# EAGLE board teensyMotors02_up_LED_SX (EAGLE 9.1.3), part 1 of 2
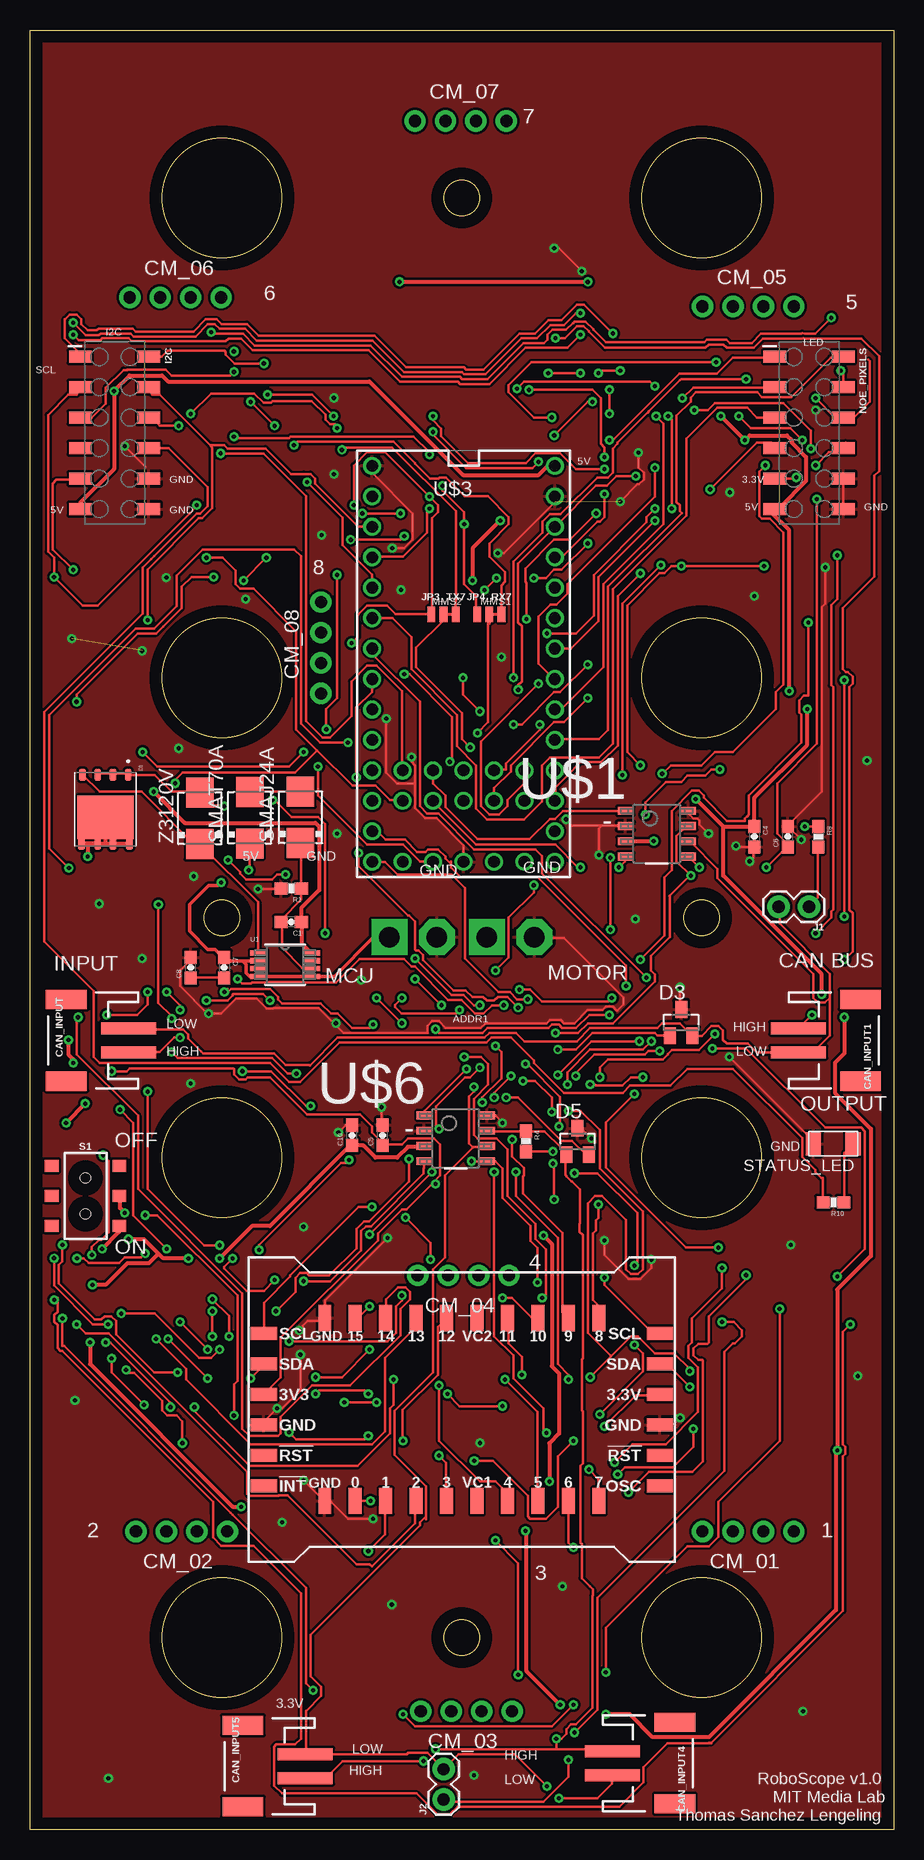
[diagram p2: board, top side]
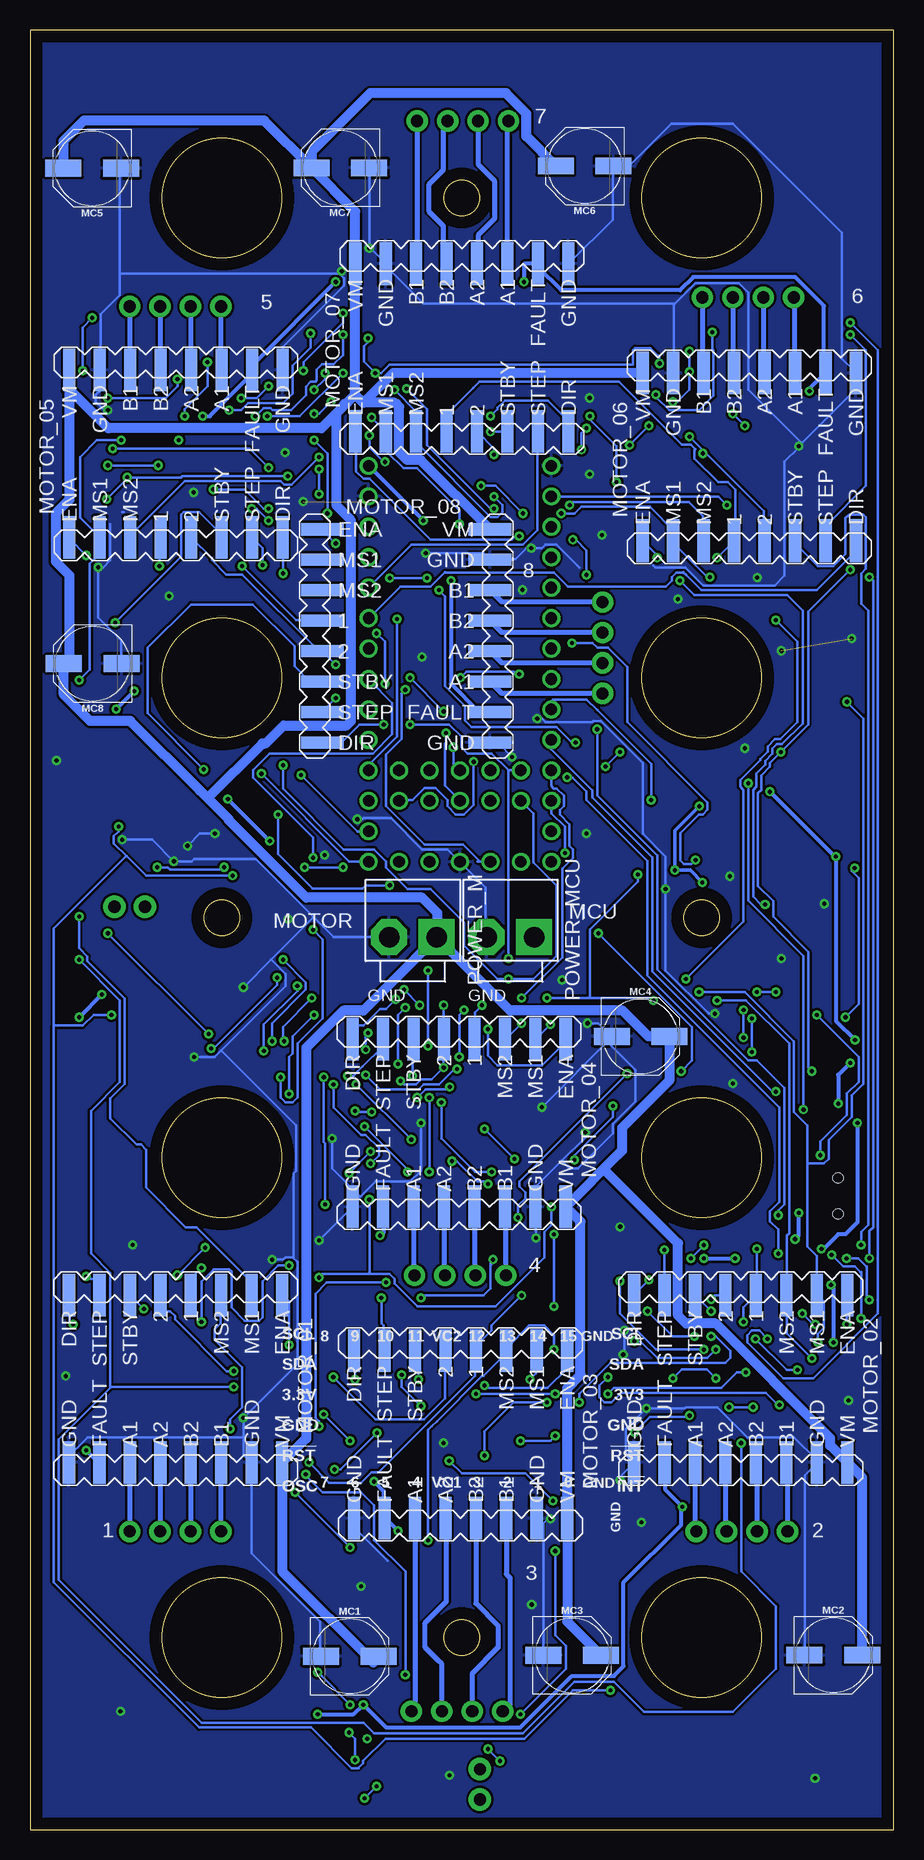
[diagram p3: board, bottom side, seen from below]

Size 72 x 150 mm. Coordinates in mm from the lower left corner, seen from the top.
Outline: 72,150 72,0 0,0 0,150 72,150
Outline: circle at 56,136 radius 5
Outline: circle at 56,96 radius 5
Outline: circle at 56,56 radius 5
Outline: circle at 56,16 radius 5
Outline: circle at 16,16 radius 5
Outline: circle at 16,56 radius 5
Outline: circle at 16,96 radius 5
Outline: circle at 16,136 radius 5
Outline: circle at 36,136 radius 1.5
Outline: circle at 16,76 radius 1.5
Outline: circle at 36,16 radius 1.5
Outline: circle at 56,76 radius 1.5
Copper layers (1*16): Top 0.035mm / dielectric 1.5mm / Bottom 0.035mm
Design rules "default *": minimum track width 6mil, minimum drill 0.35mm, track to track 6mil, track to pad 6mil, pad to pad 6mil, via to via 6mil, smd to smd 6mil, copper to edge 40mil, drill to drill 6mil, minimum pad ring 10mil, minimum via ring 8mil, stop-mask expansion 4mil, vias tented up to drill 0mil, thermal gap 10mil
Net classes: 0 default: width 0.2 mm, clearance 0.2 mm; 1 gnd: width 0.2 mm, clearance 0.2 mm; 3 vcc: width 0.2 mm, clearance 0.2 mm; 4 vcc5: width 0.35 mm, clearance 0.2 mm

## Footprints (pad centres in the part's own frame; a part is rotated, then mirrored left to right if it is on the bottom)
0603-CAP = smd 1.1 x 1: 1 -0.85,0; 2 0.85,0
JST-2-SMD = smd 1 x 4.6: 1 -1,-3.7; 2 1,-3.7 | smd 1.6 x 3.4: NC1 -3.4,1.5; NC2 3.4,1.5
1X04-CLEANBIG = drill 1.016 pad 1.778: 1 -3.81,0; 2 -1.27,0; 3 1.27,0; 4 3.81,0
SOFL127P515X615X110-9N = smd 1.03 x 0.57: 1 -2.87,1.905; 2 -2.87,0.635; 3 -2.87,-0.635; 4 -2.87,-1.905; 5 2.87,-2; 6 2.87,-0.635; 7 2.87,0.635; 8 2.87,2 | smd 3.6 x 4.7: 9 0.675,0
SOT23 = smd 1 x 1.4: 1 -0.95,-1.1; 2 0.95,-1.1; 3 0,1.1
2X6_SMD = smd 1.02 x 1.9: 1 -6.35,-2.85; 2 -6.35,2.85; 3 -3.81,-2.85; 4 -3.81,2.85; 5 -1.27,-2.85; 6 -1.27,2.85; 7 1.27,-2.85; 8 1.27,2.85; 9 3.81,-2.85; 10 3.81,2.85; 11 6.35,-2.85; 12 6.35,2.85
1X02 = drill 1.016 pad 1.88: 1 0,0; 2 2.54,0
SMT-JUMPER_3_1-NC_TRACE_NO-SILK = smd 0.635 x 1.27: 1 -1.016,0; 2 0,0; 3 1.016,0
PANASONIC_D = smd 3 x 1.4: + 2.4,0; - -2.4,0
DRV8880 = smd 3.556 x 1.016: 1 -6.985,1.27; 2 -6.985,-1.27; A1 6.985,-3.81; A2 6.985,-1.27; B1 6.985,3.81; B2 6.985,1.27; DIR -6.985,-8.89; ENA -6.985,8.89; FAULT 6.985,-6.35; GND_0 6.985,-8.89; GND_1 6.985,6.35; MS1 -6.985,6.35; MS2 -6.985,3.81; STBY -6.985,-3.81; STEP -6.985,-6.35; VM 6.985,8.89
B2P-VH = drill 1.7 pad 3 square: 1 -1.98,0 | drill 1.7 pad 3 octagon: 2 1.98,0
0603-RES = smd 1.1 x 1: 1 -0.85,0; 2 0.85,0
SWITCH_DPDT_SMD_AYZ0202 = smd 1 x 1.15: 1 -2.5,2.825; 2 0,2.825; 3 2.5,2.825; 4 -2.5,-2.825; 5 0,-2.825; 6 2.5,-2.825 | hole 0.85: 1.5,0; -1.5,0
DO214AA = smd 2.5 x 2.3: A 2.15,0; C -2.15,0
LED1206FAB = smd 1.27 x 1.905: 1 -1.651,0; 2 1.651,0
MSOP-8_MS = smd 1.397 x 0.432: 1 -2.21,0.975; 2 -2.21,0.325; 3 -2.21,-0.325; 4 -2.21,-0.975; 5 2.21,-0.975; 6 2.21,-0.325; 7 2.21,0.325; 8 2.21,0.975
MCP2562 = smd 1.27 x 0.635: CANH 2.625,0.635; CANL 2.625,-0.635; RXD -2.625,-1.905; STBY 2.625,1.905; TXD -2.625,1.905; VDD -2.625,-0.635; VIO 2.625,-1.905; VSS -2.625,0.635
TEENSY_4.0_WITH_SMD_HEADER_PINS = drill 0.965: 0 -7.62,13.97; 1 -7.62,11.43; 2 -7.62,8.89; 3 -7.62,6.35; 3.3V 7.62,11.43; 3.3V1 -2.54,-16.51; 4 -7.62,3.81; 5 -7.62,1.27; 6 -7.62,-1.27; 7 -7.62,-3.81; 8 -7.62,-6.35; 9 -7.62,-8.89; 10 -7.62,-11.43; 11 -7.62,-13.97; 12 -7.62,-16.51; 13 7.62,-16.51; 14/A0 7.62,-13.97; 15/A1 7.62,-11.43; 16/A2 7.62,-8.89; 17/A3 7.62,-6.35; 18/A4 7.62,-3.81; 19/A5 7.62,-1.27; 20/A6 7.62,1.27; 21/A7 7.62,3.81; 22/A8 7.62,6.35; 23/A9 7.62,8.89; 24 5.08,-11.43; 25 5.08,-8.89; 26 2.54,-11.43; 27 2.54,-8.89; 28 0,-11.43; 29 0,-8.89; 30 -2.54,-11.43; 31 -2.54,-8.89; 32 -5.08,-11.43; 33 -5.08,-8.89; GND -7.62,16.51; GND1 0,-16.51; GND2 7.62,13.97; PGM 2.54,-16.51; RESET 5.08,-16.51; VBAT -5.08,-16.51; VIN 7.62,16.51
SX1509 = smd 2.184 x 1.067: 0 -7.62,7.62; 1 -7.62,5.08; 2 -7.62,2.54; 3 -7.62,0; 4 -7.62,-5.08; 5 -7.62,-7.62; 6 -7.62,-10.16; 7 -7.62,-12.7; 8 7.62,-12.7; 9 7.62,-10.16; 10 7.62,-7.62; 11 7.62,-5.08; 12 7.62,0; 13 7.62,2.54; 14 7.62,5.08; 15 7.62,7.62; GND_1 7.62,10.16; GND_2 -7.62,10.16; VC2 7.62,-2.54; VCC1 -7.62,-2.54 | smd 1.067 x 2.184: 3.3V 1.27,-17.78; 3.3V_1 1.27,15.24; GND -1.27,-17.78; GND_3 -1.27,15.24; INT -6.35,15.24; OSC -6.35,-17.78; RST -3.81,-17.78; RST_1 -3.81,15.24; SCL 6.35,-17.78; SCL_2 6.35,15.24; SDA 3.81,-17.78; SDA_2 3.81,15.24

## Placement (x,y rotation side)
C1  1.5uf  [0603-CAP]  21.78,75.65 180 top
C4  0.1uf  [0603-CAP]  60.39,82.76 270 top
C5  0.1uf  [0603-CAP]  29.4,57.87 90 top
C6  0.1uf  [0603-CAP]  63.18,82.76 90 top
C7  0.1uf  [0603-CAP]  16.19,71.84 270 top
C8  0.1uf  [0603-CAP]  13.4,71.84 90 top
C10  0.1uf  [0603-CAP]  26.86,57.87 90 top
CAN_INPUT  [JST-2-SMD]  4.53,65.78 90 top
CAN_INPUT1  [JST-2-SMD]  67.76,65.78 270 top
CAN_INPUT4  [JST-2-SMD]  52.26,5.54 270 top
CAN_INPUT5  [JST-2-SMD]  19.24,5.29 90 top
CM_01  1X04_STRAIGHT  [1X04-CLEANBIG]  59.88,24.85 180 top
CM_02  1X04_STRAIGHT  [1X04-CLEANBIG]  12.64,24.85 180 top
CM_03  1X04_STRAIGHT  [1X04-CLEANBIG]  36.39,9.86 180 top
CM_04  1X04_STRAIGHT  [1X04-CLEANBIG]  36.13,46.18 180 top
CM_05  1X04_STRAIGHT  [1X04-CLEANBIG]  59.88,126.95 0 top
CM_06  1X04_STRAIGHT  [1X04-CLEANBIG]  12.13,127.72 0 top
CM_07  1X04_STRAIGHT  [1X04-CLEANBIG]  35.91,142.42 0 top
CM_08  1X04_STRAIGHT  [1X04-CLEANBIG]  24.26,98.51 90 top
D1  BSC010NE2LSI  [SOFL127P515X615X110-9N]  6.29,85.04 270 top
D3  PESD1CAN  [SOT23]  54.29,67.26 0 top
D5  PESD1CAN  [SOT23]  45.66,57.36 0 top
I2C  [2X6_SMD]  7.05,116.41 270 top
J1  [1X02]  64.96,76.92 180 top
J2  [1X02]  34.48,2.49 90 top
JP3_TX7  JUMPER-SMT_3_1-NC_TRACE_NO-SILK  [SMT-JUMPER_3_1-NC_TRACE_NO-SILK]  34.48,101.3 0 top
JP4_RX7  JUMPER-SMT_3_1-NC_TRACE_NO-SILK  [SMT-JUMPER_3_1-NC_TRACE_NO-SILK]  38.29,101.3 0 top
MC1  100uF  [PANASONIC_D]  45.34,14.45 0 bottom
MC2  100uF  [PANASONIC_D]  5.02,14.54 0 bottom
MC3  100uF  [PANASONIC_D]  26.8,14.51 0 bottom
MC4  100uF  [PANASONIC_D]  21.1,66.1 0 bottom
MC5  100uF  [PANASONIC_D]  66.82,138.47 180 bottom
MC6  100uF  [PANASONIC_D]  25.75,138.67 180 bottom
MC7  100uF  [PANASONIC_D]  46.12,138.5 180 bottom
MC8  100uF  [PANASONIC_D]  66.77,97.18 180 bottom
MOTOR_01  DRV8880  [DRV8880]  59.86,37.57 270 bottom
MOTOR_02  DRV8880  [DRV8880]  12.74,37.57 270 bottom
MOTOR_03  DRV8880  [DRV8880]  36.09,32.94 270 bottom
MOTOR_04  DRV8880  [DRV8880]  36.22,58.89 270 bottom
MOTOR_05  DRV8880  [DRV8880]  59.83,114.68 90 bottom
MOTOR_06  DRV8880  [DRV8880]  12.02,114.43 90 bottom
MOTOR_07  DRV8880  [DRV8880]  35.99,123.54 90 bottom
MOTOR_08  DRV8880  [DRV8880]  40.63,99.49 0 bottom
NOE_PIXELS  [2X6_SMD]  64.96,116.41 270 top
POWER_M  B2P-VH  [B2P-VH]  40.07,74.38 180 bottom
POWER_MCU  B2P-VH  [B2P-VH]  31.94,74.38 180 bottom
R1  1K  [0603-RES]  21.78,78.44 180 top
R4  120Ohms  [0603-RES]  41.34,57.36 270 top
R8  120Ohms  [0603-RES]  65.72,82.76 270 top
R10  500  [0603-RES]  66.99,52.28 180 top
S1  [SWITCH_DPDT_SMD_AYZ0202]  4.63,52.82 270 top
SMAJ24A  S2M  [DO214AA]  22.56,84.37 90 top
SMAT70A  S2M  [DO214AA]  18.32,84.34 90 top
STATUS_LED  LEDFAB1206  [LED1206FAB]  66.97,57.15 180 top
U1  LTC4359CMS8PBF  [MSOP-8_MS]  21.27,72.09 0 top
U$1  MCP2562  [MCP2562]  52.26,83.01 0 top
U$3  TEENSY_4.0_WITH_SMD_HEADER_PINS  [TEENSY_4.0_WITH_SMD_HEADER_PINS]  36.15,97.17 0 top
U$5  SX1509  [SX1509]  34.74,35.01 90 top
U$6  MCP2562  [MCP2562]  35.5,57.61 0 top
Z3120V  S2M  [DO214AA]  14.16,84.28 90 top

## Tracks (layer width: path | path; a pad name or v marks a point on that pad's centre or on a via)
0_SX0  (via drill 0.35)
  Top 0.2: v28.41,27.41 27.21,27.41 U$5.0 | v37.04,30.72 38.59,30.72 41.51,27.81 41.51,26.11 41.71,25.91 43.01,25.91 44.01,26.91 44.01,31.11 v45.31,32.41 | v47.51,34.61 51.11,38.21 51.11,39.71 v50.41,40.41
  Bottom 0.2: v47.51,34.61 v45.31,32.41 | v50.41,40.41 50.41,44.01 50.91,44.51 MOTOR_01.ENA | v28.41,27.41 30.67,29.67 35.99,29.67 v37.04,30.72
1_SX0  (via drill 0.35)
  Top 0.2: v28.21,23.21 29.61,24.61 29.61,27.31 U$5.1 | v48.01,13.11 48.01,16.81 54.81,23.61 56.61,23.61 57.41,24.41 57.41,27.31 62.51,32.41 v62.51,43.41 | v45.31,10.41 43.51,8.61 32.11,8.61 v31.11,9.61
  Bottom 0.2: v28.21,23.21 28.21,16.21 27.31,15.31 27.31,13.41 v31.11,9.61 | v48.01,13.11 47.71,12.81 v45.31,10.41 | v62.51,43.41 63.61,44.51 MOTOR_01.STBY
2_SX0  (via drill 0.35)
  Top 0.2: U$5.2 32.11,27.31 32.11,25.51 28.52,21.92 28.33,22.11 27.24,22.11 21.49,27.86 20.75,27.86 20.71,27.82 18.28,27.82 18.1,28 18.1,29.79 6.54,41.36 4.66,41.36 v3.91,42.11
  Bottom 0.2: v3.91,42.11 3.91,44.51 MOTOR_02.ENA
3.3V  (via drill 0.35)
  Top 0.2: v61.41,80.21 63.11,81.91 C6.1 63.11,82.01 63.11,82.21 62.31,83.01 62.31,87.21 65.61,90.51 v65.61,110.91 | v55.81,80.21 54.91,81.11 U$1.VIO | v40.71,95.01 40.71,95.41 41.01,95.71 41.01,100.31 40.71,100.61 40.71,105.51 43.71,108.51 U$3.3.3V 43.81,108.61 47.21,112.01 48.11,112.01 48.91,112.81 v50.51,112.81 | 33.66,53.96 31.41,51.71 31.01,51.71 29.01,49.71 29.01,49.11 20.91,41.01 20.91,37.71 19.51,36.31 U$5.3.3V_1 | 33.66,53.96 34.21,54.51 34.21,57.11 33.71,57.61 31.51,57.61 31.01,57.11 29.41,57.11 C5.1 29.41,57.21 28.51,58.11 28.51,58.61 27.51,59.61 23.11,59.61 20.02,62.69 18.15,62.69 17.99,62.53 17.43,62.53 17.03,62.92 17.03,63.38 16.96,63.45 8.32,63.45 8.07,63.21 v6.81,63.21 | v36.81,55.71 38.11,55.71 U$6.VIO 38.21,55.71 38.81,55.71 39.41,55.11 39.41,52.63 41.73,50.31 41.73,49.06 42.31,48.48 42.31,45.93 | v33.81,53.81 33.71,53.91 33.66,53.96 | v47.91,33.61 50.51,36.21 52.51,36.21 U$5.3.3V | 42.31,46.01 42.31,45.93 | 42.31,45.93 v42.31,45.61 | v3.61,105.01 1.91,106.71 1.91,112.21 2.21,112.51 4.11,112.51 I2C.9 | v24.01,88.61 24.01,86.21 28.11,82.11 31.11,82.11 32.51,80.71 33.61,80.71 U$3.3.3V1 | v63.91,112.71 63.81,112.61 62.21,112.61 NOE_PIXELS.9 | v22.81,89.81 21.6,88.6 10.61,88.6 v9.41,89.81
  Bottom 0.2: v61.41,80.21 60.51,80.21 60.31,80.01 56.01,80.01 v55.81,80.21 | 34.71,80.71 34.48,80.71 | 34.48,80.71 33.61,80.71 U$3.3.3V1 | v40.71,95.01 41.01,94.71 41.01,90.91 42.31,89.61 42.31,85.31 39.11,82.11 35.88,82.11 34.48,80.71 | 63.81,112.71 59.41,112.71 59.31,112.81 v50.51,112.81 | 63.81,112.71 v63.91,112.71 63.81,112.71 | 63.81,112.71 v65.61,110.91 | v36.81,55.71 36.41,55.71 34.71,54.01 34.01,54.01 v33.81,53.81 | v47.91,33.61 47.91,34.01 48.21,34.31 48.21,39.81 48.2,39.81 48.2,44.66 47.25,45.61 v42.31,45.61 42.41,45.61 | v3.61,105.01 7.11,101.51 7.11,92.11 v9.41,89.81 10.31,88.91 10.31,88.59 11.03,87.87 11.03,86.65 11.31,86.38 11.31,78.66 10.03,77.39 10.03,76.08 7.11,73.16 7.11,63.51 v6.81,63.21 | v22.81,89.81 v24.01,88.61
3_SX0  (via drill 0.35)
  Top 0.2: v34.11,31.17 34.71,30.57 34.71,27.41 U$5.3 | v26.21,35.61 v28.91,35.61 | v15.21,43.21 v15.21,41.11
  Bottom 0.2: v26.21,35.61 26.21,36.31 23.61,38.91 14.01,38.91 13.61,39.31 13.61,39.91 14.81,41.11 v15.21,41.11 | v15.21,43.21 16.51,44.51 MOTOR_02.STBY | v28.91,35.61 31.7,35.61 34.11,33.2 v34.11,31.17
4_SX0  (via drill 0.35)
  Top 0.2: v34.11,37.01 34.11,32.41 37.51,29.01 38.81,29.01 39.81,28.01 39.81,27.41 U$5.4
  Bottom 0.2: MOTOR_03.ENA 27.21,39.91 27.21,38.44 28.84,36.81 33.91,36.81 v34.11,37.01
5_SX0  (via drill 0.35)
  Top 0.2: v39.61,37.51 42.31,34.81 42.31,27.41 U$5.5
  Bottom 0.2: v39.61,37.51 39.61,39.71 39.81,39.91 MOTOR_03.STBY
6_SX0  (via drill 0.35)
  Top 0.2: v45.31,23.51 44.91,23.91 44.91,27.31 U$5.6 | v49.91,28.11 51.6,29.8 55.22,29.8 56.11,30.69 56.11,39.07 56.06,39.13 55.73,39.13 55.33,39.52 55.33,40.09 55.73,40.48 56.47,40.48 56.61,40.62 56.61,42.77 59.71,45.87 v59.71,46.21 | v57.41,48.51 54.71,48.51 48.03,55.18 48.03,58.93 v50.41,61.31 | v48.31,67.91 46.64,67.91 45.54,66.81 44.37,66.81 44.09,67.08 43.53,67.08 43.25,66.81 38.14,66.81 37.74,66.41 34.11,66.41 v33.81,66.71
  Bottom 0.2: v49.91,28.11 v45.31,23.51 | v57.41,48.51 v59.71,46.21 | v50.41,61.31 50.41,64.41 50.11,64.71 50.11,66.11 v48.31,67.91 | v33.81,66.71 33.81,64.51 33.01,63.71 29.31,63.71 27.41,65.61 27.41,65.81 MOTOR_04.ENA
7_SX0  (via drill 0.35)
  Top 0.2: v46.61,30.01 47.41,29.21 47.41,27.41 U$5.7 | v38.71,54.81 38.71,41.11 40.31,39.51 40.31,37.61 42.8,35.11 42.8,33.31 v43.05,33.05 | v38.71,61.01 38.71,61.41 v40.11,62.81
  Bottom 0.2: v43.05,33.05 46.1,30.01 v46.61,30.01 | v38.71,61.01 v38.71,54.81 | v40.11,62.81 40.11,65.81 MOTOR_04.STBY
8_SX0  (via drill 0.35)
  Top 0.2: 47.41,42.71 U$5.8 47.44,43.64 46.93,44.15 46.93,49.67 47.18,49.92 47.18,50.49 47.18,50.75 47.41,50.98 v47.41,52.11 | v57.11,66.31 55.78,64.98 53.53,64.98 53.18,64.63 53.18,64.62 52.77,64.21 48.19,64.21 47.51,63.52 v47.51,62.71 | v67.31,106.21 67.31,102.57 66.81,102.07 66.81,95.38 66.98,95.21 66.98,76.7 66.81,76.53 66.81,76.01 v65.51,74.71
  Bottom 0.2: v47.41,52.11 47.41,57.21 47.51,57.31 v47.51,62.71 | v65.51,74.71 v57.11,66.31 | v67.31,106.21 68.71,107.61 MOTOR_05.ENA
9_SX0  (via drill 0.35)
  Top 0.2: v40.21,57.51 40.21,56.11 41.18,55.13 41.18,54.52 41.09,54.43 41.09,53.04 44.41,49.72 44.41,43.12 U$5.9 44.81,42.71 | v44.81,62.11 44.81,63.11 46.71,65.01 51.11,65.01 v51.81,65.71 | v64.91,100.61 64.91,94.51 64.52,94.51 64.13,94.12 64.13,93.12 64.33,92.92 64.33,90.6 59.93,86.2 59.93,84.58 59.8,84.46 59.77,84.46 59.59,84.28 59.59,84.08 58.1,84.08 56.18,86 56.18,86.19 55.79,86.58 55.18,86.58 53.51,84.91 53.51,80.54 53.53,80.51 53.53,79.96 52.91,79.34 52.91,74.51 v50.91,72.51
  Bottom 0.2: v44.81,62.11 v40.21,57.51 | v51.81,65.71 51.81,67.21 49.01,70.01 49.01,70.61 v50.91,72.51 | v64.91,100.61 59.41,106.11 59.41,109.61 59.21,109.81 57.91,109.81 56.11,108.01 56.11,107.71 MOTOR_05.STBY
10_SX0  (via drill 0.35)
  Top 0.2: v39.41,44.31 40.21,44.31 41.81,42.71 42.31,42.71 U$5.10 | v33.41,47.51 33.41,48.91 v31.31,51.01 | 21.51,63.01 v22.21,63.01 21.47,63.01 20.17,64.31 12.31,64.31 v11.81,64.81 | v11.81,67.61 11.81,67.81 10.71,68.91 v10.71,77.11 | v19.71,106.01 v17.81,104.11
  Bottom 0.2: v39.41,44.31 39.21,44.51 34.21,44.51 33.61,45.11 33.61,47.01 33.51,47.11 33.61,47.21 33.61,47.31 v33.41,47.51 | v31.31,51.01 31.31,52.01 30.71,52.61 30.71,53.11 31.21,53.61 31.21,54.01 v22.21,63.01 | v11.81,67.61 v11.81,64.81 | v17.81,104.11 16.61,102.91 8.87,102.91 7.58,101.61 7.58,92.2 9.29,90.48 9.74,90.48 10.1,90.12 10.1,89.68 10.71,89.07 10.71,88.75 11.43,88.03 11.43,86.92 11.71,86.65 11.71,77.76 11.05,77.11 v10.71,77.11 | v19.71,106.01 19.71,106.21 20.91,107.41 MOTOR_06.ENA
11_SX0  (via drill 0.35)
  Top 0.2: v41.01,37.91 41.01,39.41 39.91,40.51 39.91,42.61 U$5.11 | v39.41,35.29 35.82,35.29 v34.81,36.31 | 11.54,38.11 11.62,38.11 | 11.62,38.11 v12.31,38.11 | 11.62,38.11 10.36,38.11 7.18,41.28 7.18,42.39 6.79,42.78 6.23,42.78 5.95,42.51 5.4,42.51 2.41,45.5 2.41,47.06 2.71,47.36 v2.71,48.72 2.73,48.7 | v23.81,36.31 24.11,36.61 27.91,36.61 v28.21,36.31
  Bottom 0.2: v39.41,35.29 41.01,36.89 v41.01,37.91 | v28.21,36.31 v34.81,36.31 | v2.71,48.72 2.71,49.81 2.11,50.41 2.11,101.61 2.71,102.21 2.71,104.71 2.31,105.11 2.31,109.41 2.51,109.61 3.71,109.61 4.01,109.31 4.01,106.31 5.01,105.31 6.31,105.31 8.21,107.21 8.21,107.41 MOTOR_06.STBY 8.21,107.71 | v12.31,38.11 13.07,38.11 14.36,36.81 23.3,36.81 v23.81,36.31
12_SX0  (via drill 0.35)
  Top 0.2: 21.91,32.81 v21.61,33.11 22.21,32.51 27.91,32.51 v28.21,32.81 | v17.01,34.51 17.01,37.11 17.31,37.41 17.31,44.51 10.61,51.21 v9.61,51.21 | v24.71,91.71 24.71,93.41 25.6,94.3 v25.6,104.58 | v26.74,107.51 30.91,107.51 v31.21,107.81 | 34.71,42.61 U$5.12 34.01,41.9 34.01,37.91 31.06,34.96 31.06,32.45 v31.11,32.41
  Bottom 0.2: v31.11,32.41 28.61,32.41 v28.21,32.81 | v21.61,33.11 20.31,34.41 17.11,34.41 v17.01,34.51 | v9.61,51.21 9.61,51.61 9.11,52.11 9.11,61.81 11.41,64.11 12.11,64.11 19.71,71.71 19.71,81.21 24.71,86.21 v24.71,91.71 | v31.21,107.81 31.51,107.81 31.81,107.51 38.61,107.51 43.71,112.61 44.21,112.61 44.81,113.21 44.81,116.51 MOTOR_07.ENA | v26.74,107.51 26.49,107.51 25.6,106.61 v25.6,104.58
13_SX0  (via drill 0.35)
  Top 0.2: v10.51,40.91 13.01,38.41 13.01,37.51 18.41,32.11 28.51,32.11 29.61,33.21 29.61,39.33 32.11,41.83 32.11,42.61 U$5.13 | v45.91,126.41 45.51,126.41 44.51,125.41 43.38,125.41 42.28,124.31 40.98,124.31 37.97,121.3 36.19,121.3 36,121.48 31.18,121.48 28.56,124.11 18.9,124.11 17.93,125.08 15.79,125.08 15.39,125.48 14.83,125.48 13.79,124.45 8.65,124.45 8.4,124.71 5.88,124.71 5.73,124.56 4.65,124.56 v3.61,125.61 | v49.21,121.61 47.61,121.61 v47.41,121.41 | v48.31,118.01 v48.31,120.01 | v46.91,119.01 46.51,119.01 v43.71,116.21 | v42.41,114.01 41.9,113.5 36.36,113.5 33.61,116.25 v33.61,116.51
  Bottom 0.2: v10.51,40.91 11.21,41.61 11.81,41.61 12.21,41.21 12.21,40.61 9.21,37.61 6.71,37.61 1.31,43.01 1.31,123.31 v3.61,125.61 | v45.91,126.41 45.91,125.61 49.21,122.31 v49.21,121.61 | v47.41,121.41 47.41,120.91 v48.31,120.01 | v48.31,118.01 47.91,118.01 v46.91,119.01 | v43.71,116.21 43.71,115.21 42.51,114.01 v42.41,114.01 | v33.61,116.51 32.21,116.51 MOTOR_07.STBY
14_SX0  (via drill 0.35)
  Top 0.2: v4.01,67.71 3.91,67.61 3.91,64.61 9.01,59.51 9.01,53.41 17.71,44.71 17.71,33.41 18.31,32.81 20.71,32.81 20.91,33.01 20.91,34.41 23.51,37.01 26.71,37.01 30.91,41.21 30.91,43.41 31.71,44.21 31.71,44.81 31.31,45.21 30.71,45.21 29.71,44.21 29.71,42.71 U$5.14 | v3.24,80.15 1.61,81.79 1.61,92.91 8.81,100.11 10.36,100.11 12.23,101.97 12.23,104.53 14.41,106.71 22.04,106.71 22.61,106.14 22.61,92.21 24.21,90.61 v26.51,90.61 | v38.91,104.31 v37.91,103.31 | v42.01,104.31 43.01,104.31 43.71,105.01 44.31,105.01 v46.51,107.21
  Bottom 0.2: v26.51,90.61 26.81,90.61 28.11,91.91 35.21,91.91 35.73,92.42 35.73,93.65 37.38,95.31 37.38,102.78 v37.91,103.31 | v42.01,104.31 v38.91,104.31 | v46.51,107.21 47.61,108.31 MOTOR_08.ENA | v3.24,80.15 3.5,79.9 2.91,79.31 2.91,68.81 v4.01,67.71
15_SX0  (via drill 0.35)
  Top 0.2: v28.31,43.61 27.41,42.71 27.21,42.71 U$5.15 | v33.51,54.81 v28.31,49.61 | v37.71,60.61 37.71,61.01 39.31,62.61 39.31,64.8 v38.81,65.31 | v38.81,71.61 39.91,72.71 39.91,76.01 42.01,78.11 v42.01,78.71 | v57.51,88.37 56.83,88.37 56.32,87.86 54.82,87.86 | 54.8,87.84 54.82,87.86 | 54.82,87.86 | 54.82,87.86 54.29,87.33 53.43,87.33 53.42,87.33 53.02,87.33 51.31,85.61 v51.31,84.61
  Bottom 0.2: v28.31,49.61 v28.31,43.61 | v33.51,54.81 34.91,54.81 37.71,57.61 v37.71,60.61 | v38.81,71.61 v38.81,65.31 | 47.91,95.71 47.71,95.71 | 62.21,98.51 62.21,93.06 v57.51,88.37 | v42.01,78.71 44.01,78.71 44.27,78.44 48.45,78.44 51.31,81.29 v51.31,84.61 | 47.71,95.71 MOTOR_08.STBY | 62.21,98.51 | 62.21,98.51 | 62.21,98.51 62.18,98.51 58.57,102.12 53.43,102.12 49.95,98.64 49.95,96.96 48.7,95.71 47.71,95.71
28_INT_01  (via drill 0.35)
  Top 0.2: JP4_RX7.2 38.29,100.54 38.21,100.51 38.21,92.31 v37.31,91.41
  Bottom 0.2: v37.31,91.41 37.31,90.61 37.41,90.51 37.41,87.01 36.21,85.81 U$3.28
29_INT_02  (via drill 0.35)
  Top 0.2: 36.61,90.31 v36.71,90.21 36.01,90.91 36.01,93.07 32.2,96.88 32.2,98.51 34.48,100.79 JP3_TX7.2
  Bottom 0.2: v36.71,90.21 36.71,88.81 36.21,88.31 U$3.29
CAN_H  (via drill 0.35)
  Top 0.2: v64.61,83.61 65.71,83.61 R8.1 | U$1.CANH 54.81,83.71 53.91,82.81 53.91,80.71 v55.11,79.51 55.01,79.51 53.36,77.85 | v44.01,65.01 45.51,65.01 46.91,66.41 52.11,66.41 52.31,66.21 53.31,66.21 D3.1 | v43.81,66.41 45.71,66.41 46.51,67.21 48.61,67.21 52.08,70.68 52.08,71.29 51.79,71.58 51.79,72.82 53.36,74.39 53.36,77.85 | 53.36,77.85 53.31,77.81 | v12.51,66.01 12.01,66.01 10.81,64.81 8.31,64.81 CAN_INPUT.1 | v12.51,68.31 12.51,68.71 v11.41,69.81 | v2.71,42.61 2.71,40.31 2.83,40.31 16.74,26.4 | v65.21,67.91 64.11,66.81 CAN_INPUT1.1 | 16.91,26.23 16.74,26.4 | v6.41,67.91 8.95,67.91 9.81,68.77 v9.81,69.81 | 16.74,26.4 23.01,20.13 23.01,12.21 v23.61,11.61 | v6.11,56.21 6.58,55.74 6.58,49.77 5.95,49.15 5.75,49.15 5.16,48.55 v5.16,47.9
  Bottom 0.2: v64.61,83.61 64.61,83.21 65.01,82.81 65.01,82.21 63.96,81.16 | 63.96,81.16 62.31,79.51 v55.11,79.51 | v44.01,65.01 44.01,66.21 v43.81,66.41 | v12.51,68.31 v12.51,66.01 | v9.81,69.81 v11.41,69.81 | v2.71,42.61 2.71,46.46 2.76,46.46 3.24,46.94 3.63,46.94 3.64,46.93 4.2,46.93 v5.16,47.9 | 24.01,11.61 v23.61,11.61 26.74,11.61 30.77,7.57 42.36,7.57 44.22,5.71 44.22,5.51 44.61,5.13 44.61,5.11 44.62,5.12 45.18,5.12 48.57,8.51 57.91,8.51 70.01,20.61 70.01,67.01 | 70.01,67.01 70.01,75.11 64.01,81.11 63.96,81.16 | v65.21,67.91 66.71,67.91 67.61,67.01 70.01,67.01 | 6.14,56.24 v6.11,56.21 6.11,57.34 3.88,59.56 3.88,61.35 2.91,62.33 2.91,64.41 v6.41,67.91
CAN_H2  (via drill 0.35)
  Top 0.2: U$6.CANH 38.21,58.21 41.31,58.21 R4.1 41.41,58.21 42.91,58.21 44.31,56.81 44.31,56.71 44.71,56.31 D5.1 44.64,56.19 44.64,54.56 44.73,54.48 44.73,54.42 45.13,54.03 45.18,54.03 45.86,53.34 45.86,50.52 45.83,50.49 45.83,49.82 46.11,49.54 46.11,39.26 46.03,39.19 46.03,34.92 46.11,34.85 46.11,30.51 45.91,30.31 45.91,23.91 46.01,23.81 | 23.04,4.31 CAN_INPUT5.1 24.66,4.29 26.08,5.71 v32.81,5.71 | v33.81,6.71 43.88,6.71 | 43.88,6.71 48.4,6.71 CAN_INPUT4.1 | 46.01,23.81 | 46.01,23.81 | 46.01,23.81 46.01,20.94 46.67,20.27 46.93,20.02 46.93,19.52 46.91,19.5 46.91,10.15 45.52,8.76 45.12,8.76 44.73,8.36 44.73,7.97 44.33,7.57 v43.88,7.57 43.88,6.71
  Bottom 0.2: v33.81,6.71 v32.81,5.71
CAN_L
  Top 0.2: 66.71,68.28 66.71,66.21 65.31,64.81 64.11,64.81 CAN_INPUT1.2 | 66.71,68.28 66.71,71.31 62.51,75.51 62.51,76.91 J1.2 | U$1.CANL 54.91,82.31 55.11,82.31 57.33,80.08 57.33,79.31 65.33,71.31 65.33,69.32 65.73,68.93 66.29,68.93 66.68,69.32 66.68,69.91 66.71,69.93 66.71,68.28 | 55.31,66.21 D3.2 | 8.31,66.71 CAN_INPUT.2 8.33,66.68 12.79,66.68 13.18,66.29 13.18,65.94 14.28,64.84 14.42,64.71 20.34,64.71 21.31,63.74 23.28,63.74 23.31,63.71 23.34,63.71 25.64,66.01 37.91,66.01 38.31,66.41 40.52,66.41 41.22,65.71 45.61,65.71 46.71,66.81 52.31,66.81 52.71,67.21 54.21,67.21 55.21,66.21 D3.2 | 62.81,64.81 64.01,64.81 CAN_INPUT1.2 | CAN_INPUT1.2 60.59,64.78 59.87,65.51 58.1,65.51 57.78,65.83 57.78,66.59 57.39,66.98 56.83,66.98 56.01,66.16 D3.2
CAN_L2  (via drill 0.35)
  Top 0.2: 36.96,56.86 34.61,54.51 34.61,47.71 33.61,46.71 33.61,38.11 30.41,34.91 30.41,31.23 33.03,28.6 33.03,26.12 | 36.96,56.86 37.01,56.91 38.11,56.91 U$6.CANL | 23.01,9.86 23.01,6.31 CAN_INPUT5.2 31.42,6.29 31.51,6.38 33.13,6.38 34.41,5.11 J2.2 | 23.01,9.86 23.01,9.91 | v39.71,61.01 40.71,61.01 44.31,57.41 45.21,57.41 46.31,56.31 46.61,56.31 D5.2 | v37.01,61.91 37.01,61.51 36.61,61.11 36.61,57.21 36.91,56.91 36.96,56.86 | v44.11,2.61 47.31,2.61 48.51,3.81 48.51,4.51 CAN_INPUT4.2 | 34.51,5.01 J2.2 | 33.03,26.12 33.03,25.86 | 33.03,26.12 32.51,25.59 32.51,25.34 23.41,16.24 23.41,12.76 24.28,11.89 24.28,11.14 23.01,9.86 | J2.2 35.71,6.26 40.45,6.26 v43.11,3.61
  Bottom 0.2: v39.71,61.01 39.01,61.71 37.21,61.71 v37.01,61.91 | v43.11,3.61 v44.11,2.61
CAN_RX2  (via drill 0.35)
  Top 0.2: v15.81,40.01 15.11,39.31 14.11,39.31 10.41,43.01 v7.61,43.01 | 32.81,55.71 U$6.RXD 32.87,55.13 32.83,55.09 32.83,54.69 28.42,50.28 28.03,50.28 27.62,49.88 27.62,48.29 25.04,45.71 v22.81,45.71 | I2C.3 3.91,119.61 3.21,119.61 1.51,117.91 1.51,106.51 2.01,106.01 v2.01,104.41 4.39,102.02 5.63,102.02 13.35,109.74 13.91,110.3 v13.91,110.41 | v2.01,47.62 2.01,45.34 5.24,42.11 v6.51,42.11
  Bottom 0.2: v22.81,45.71 22.81,43.01 19.81,40.01 v15.81,40.01 | v7.61,43.01 6.71,42.11 v6.51,42.11 | v2.01,47.62 2.01,49.91 1.71,50.21 1.71,104.11 v2.01,104.41 | v13.91,110.41 14.61,111.11 28.51,111.11 U$3.0
CAN_RX3  (via drill 0.35)
  Top 0.2: v49.11,80.21 49.61,80.71 49.61,81.11 U$1.RXD | v45.91,80.21 45.71,80.21 43.81,82.11 37.21,82.11 33.61,85.71 U$3.30
  Bottom 0.2: v45.91,80.21 v49.11,80.21
CAN_TX2  (via drill 0.35)
  Top 0.2: v36.41,63.41 32.91,59.91 32.91,59.61 U$6.TXD | v44.01,62.91 46.81,65.71 v50.81,65.71 | v40.81,70.01 41.71,70.01 42.67,69.04 48.24,69.04 v48.51,69.31 | v39.51,68.71 38.51,68.71 37.81,68.01 37.11,68.01 35.96,69.15 34.86,69.15 32.08,71.93 31.83,71.93 31.18,72.58 27.48,72.58 25.5,70.6 22.66,70.6 22.6,70.66 19.95,70.66 19.89,70.6 18.51,70.6 18.44,70.53 17.68,70.53 | v17.31,70.91 17.68,70.53 | 17.68,70.53 17.71,70.51 | 15.06,115.36 10.81,119.61 10.21,119.61 I2C.4 | 15.06,115.36 15.21,115.21 15.21,110.14 14.37,109.31 14.07,109.31 9.81,105.04 v9.81,100.81 | 27.81,108.61 27.88,108.61 | 27.88,108.61 28.51,108.61 U$3.1 | 15.06,115.36 15.11,115.41 15.13,115.38 16.19,115.38 16.47,115.11 19.63,115.11 21.77,112.97 22.81,112.97 22.83,112.98 23.39,112.98 23.78,112.59 23.78,112.19 27.37,108.61 27.88,108.61
  Bottom 0.2: v36.41,63.41 36.61,63.41 37.91,62.11 39.21,62.11 39.61,61.71 42.81,61.71 v44.01,62.91 | v50.81,65.71 50.91,65.81 50.91,66.91 v48.51,69.31 | v39.51,68.71 v40.81,70.01 | v17.31,70.91 12.51,75.71 12.51,86.65 12.78,86.92 12.78,87.49 11.11,89.16 11.11,89.24 10.5,89.84 10.5,90.29 9.9,90.89 9.46,90.89 8.02,92.32 8.02,99.02 v9.81,100.81
CAN_TX3
  Top 0.2: 49.61,84.91 U$1.TXD 49.6,84.88 44.43,84.88 43.78,84.23 43.34,84.23 41.66,82.55 37.33,82.55 34.64,85.23 34.64,86.17 33.61,87.2 U$3.31
GND_MCU  (via drill 0.35)  (2 unrouted)
  Top 0.2: v22.81,29.11 24.51,27.41 U$5.GND_2 24.61,27.31 25.11,27.31 26.51,25.91 v28.61,25.91 | U$5.GND_3 19.51,33.81 19.51,34.01 v20.61,35.11 21.04,35.11 22.54,36.61 v22.54,39.58 | v39.41,58.91 38.81,59.51 38.21,59.51 U$6.STBY | v46.81,57.61 46.01,58.41 45.71,58.41 D5.3 | v54.21,34.31 53.71,33.81 52.61,33.81 U$5.GND | v47.91,49.11 47.91,47.91 49.91,45.91 50.91,45.91 51.81,46.81 v51.81,47.51 | 47.69,83.71 49.21,83.71 49.61,83.71 U$1.VSS | v44.71,84.21 45.21,83.71 47.69,83.71 | v31.81,89.41 31.81,89.01 32.11,88.71 32.11,87.21 | 32.11,87.21 32.11,85.55 32.11,85.14 32.95,84.3 33.88,84.3 36.15,82.03 U$3.GND1 36.11,80.71 | v25.71,58.11 26.31,58.71 26.81,58.71 C10.2 | v29.81,49.31 24.61,44.11 24.61,42.71 U$5.GND_1 24.33,42.38 23.13,42.38 22.73,41.99 22.73,41.87 v22.45,41.59 | C5.2 29.31,58.81 v29.31,60.21 | 32.81,58.31 U$6.VSS | v25.51,67.21 25.34,67.21 | C8.2 13.31,72.61 13.31,72.41 12.51,71.61 12.51,70.31 14.86,67.96 v14.91,68.01 15.93,68.01 17.19,69.26 18.89,69.26 19.73,68.43 20.29,68.43 20.33,68.47 24.08,68.47 25.34,67.21 | v19.01,78.41 20.91,78.41 R1.2 | 32.11,87.21 30.61,87.21 29.71,88.11 v29.71,92.61 | v30.21,106.81 31.21,106.81 31.91,107.51 31.91,109.71 28.61,113.01 28.61,113.61 U$3.GND | 9.61,113.61 v7.91,115.31 | v60.01,80.71 60.31,81.01 60.31,81.91 C4.2 58.95,81.91 v58.87,82 | v64.31,82.51 63.21,83.61 C6.2 63.21,83.71 66.01,86.51 66.01,101.91 66.31,102.21 v66.31,105.21 | v54.21,70.21 54.21,68.41 D3.3 | v58.31,64.41 65.31,57.41 65.31,57.21 STATUS_LED.2 | v43.71,131.81 44.11,131.81 v46.01,129.91 | 32.51,66.41 32.45,66.41 | 32.45,66.41 28.39,66.41 | 28.39,66.41 28.31,66.41
  Top 0.2: POWER_M.2 42.11,74.31 44.51,74.31 49.47,69.34 49.47,68.79 48.96,68.28 48.89,68.28 48.59,68.58 48.03,68.58 47.75,68.31 46.48,68.31 45.38,67.21 44.53,67.21 44.25,67.48 43.36,67.48 43.08,67.21 37.98,67.21 37.58,66.81 34.67,66.81 34.09,67.38 33.53,67.38 33.13,66.99 33.13,66.42 33.15,66.41 32.45,66.41 | U$1.STBY 54.89,84.7 55.33,84.26 55.65,84.26 55.82,84.09 55.82,83.77 v56.58,83.01 | 28.39,66.41 26.14,66.41 25.34,67.21 | v39.01,106.41 39.51,106.41 43.77,110.66 U$3.GND2 | NOE_PIXELS.10 NOE_PIXELS.12 | v49.21,110.7 50.64,112.13 50.79,112.13 51.18,112.52 51.18,113.09 50.74,113.53 v50.74,114.76 | v47.44,81.23 47.44,83.45 47.69,83.71
  Bottom 0.2: v22.81,29.11 22.81,29.41 21.71,30.51 MOTOR_02.GND_0 21.71,30.61 22.31,31.21 22.31,33.41 v20.61,35.11 17.41,35.11 17.31,35.21 14.71,35.21 12.21,32.71 8.31,32.71 6.41,30.81 6.41,30.61 MOTOR_02.GND_1 6.41,30.51 7.41,29.51 7.41,14.61 MC2.- | 29.26,25.46 29.71,25.91 MOTOR_03.GND_1 | 29.26,25.46 29.21,25.41 29.21,22.61 29.21,14.61 MC3.- 29.31,14.61 | 42.21,22.41 44.91,25.11 44.91,25.91 MOTOR_03.GND_0 | v39.41,58.91 39.41,54.91 40.31,54.01 43.21,54.01 44.46,52.76 | 44.46,52.76 45.01,52.21 45.01,51.91 MOTOR_04.GND_0 | v46.81,57.61 46.81,55.11 44.51,52.81 44.46,52.76 | 54.21,32.71 54.21,31.21 53.61,30.61 MOTOR_01.GND_1 53.51,30.51 53.51,23.01 47.81,17.31 47.81,14.51 MC1.- 47.71,14.41 | 54.21,32.71 v54.21,34.31 49.71,38.81 49.71,47.31 50.06,47.66 | 54.21,32.71 67.21,32.71 68.71,31.21 68.71,30.61 MOTOR_01.GND_0 | v47.91,49.11 MOTOR_04.GND_0 | v51.81,47.51 50.91,47.51 50.71,47.71 50.11,47.71 50.06,47.66 | MOTOR_04.GND_0 | v28.61,25.91 28.81,25.91 29.21,25.51 29.26,25.46 | v44.71,84.21 44.31,84.21 44.21,84.31 41.91,84.31 39.31,81.71 37.21,81.71 36.21,80.71 U$3.GND1 36.11,80.61 34.01,78.51 34.01,74.41 POWER_MCU.2 | v31.81,89.41 32.91,90.51 33.61,90.51 MOTOR_08.GND_0 | v25.71,58.11 25.71,57.71 27.66,55.76 | 27.66,55.76 29.81,53.61 29.81,51.91 | 29.81,51.91 MOTOR_04.GND_1 29.81,51.91 | 29.81,51.91 v29.81,49.31 | v25.51,67.21 24.61,67.21 MC4.- | v14.91,68.01 15.41,68.01 19.01,71.61 v19.01,78.41 19.01,81.11 20.91,83.01 20.91,88.91 24.41,92.41 25.01,92.41 25.11,92.31 29.01,92.31 29.31,92.61 v29.71,92.61 | v29.31,60.21 23.51,66.01 MC4.- | 27.66,55.76 27.61,55.71 27.01,55.11 26.31,55.11 23.41,58.01 23.41,58.81 21.51,60.71 21.51,63.31 23.81,65.61 MC4.-
  Bottom 0.2: v39.01,106.41 34.21,106.41 33.71,105.91 MOTOR_08.GND_1 33.61,105.91 31.51,105.91 30.61,106.81 v30.21,106.81 29.31,106.81 29.01,107.11 28.11,107.11 26.36,105.36 26.21,105.21 | MOTOR_07.GND_0 27.01,130.61 23.41,134.21 23.41,138.61 MC6.- 23.31,138.71 22.01,138.71 18.51,142.21 13.41,142.21 4.31,133.11 4.31,122.61 3.21,121.51 MOTOR_06.GND_0 3.21,121.41 3.21,120.01 v7.91,115.31 | 43.66,131.86 42.41,130.61 MOTOR_07.GND_1 42.31,130.51 42.31,130.31 39.21,127.21 18.31,127.21 18.26,127.16 | 43.66,131.86 43.71,131.91 43.71,138.41 MC7.- | 18.26,127.16 16.51,128.91 12.91,128.91 12.11,128.11 12.11,120.01 7.71,115.61 v7.91,115.31 | 18.26,127.16 18.31,127.11 18.31,121.51 MOTOR_06.GND_1 | v7.91,115.31 7.91,115.21 9.11,114.01 9.11,104.51 9.91,103.71 15.86,103.71 17.36,105.21 19.87,105.21 20.02,105.36 | 64.51,129.71 64.51,127.91 66.11,126.31 66.11,121.71 MOTOR_05.GND_1 66.21,121.61 66.21,119.91 66.51,119.61 66.51,119.01 65.81,118.31 v65.51,118.31 | 64.51,129.71 64.51,138.41 MC5.- | 46.21,129.71 45.81,129.31 45.81,128.71 50.91,123.61 50.91,121.71 MOTOR_05.GND_0 | 64.51,129.71 46.21,129.71 | MC8.- 64.41,97.21 64.41,99.11 66.31,101.01 v66.31,105.21 65.91,105.21 65.31,105.81 65.31,108.81 | 64.31,109.81 64.21,109.81 | 48.36,76.06 46.71,74.41 42.11,74.41 POWER_M.2 | 48.36,76.06 53.21,80.91 58.31,80.91 58.51,80.71 v60.01,80.71 61.81,82.51 v64.31,82.51 | 51.91,72.51 48.41,76.01 48.36,76.06 | 51.91,72.51 v54.21,70.21 | v58.31,64.41 56.61,64.41 56.06,64.96 | 56.06,64.96 50.71,70.31 50.71,71.31 51.91,72.51 | 46.21,129.71 v46.01,129.91 | v43.71,131.81 43.66,131.86 | 50.06,47.66 50.01,47.71 50.01,54.71 49.81,54.91 49.81,58.71 56.01,64.91 56.06,64.96
  Bottom 0.2: v58.87,82 57.85,83.01 v56.58,83.01 | v22.45,41.59 22.45,39.68 v22.54,39.58
  other vias: 6.54,4.27 64.45,9.86 63.44,48.72 3.75,35.77 69.03,37.8 69.79,89.11 44.39,20.27 9.34,72.6 50.48,75.9 30.16,18.75 60.39,102.82 11.37,104.35 5.78,77.17 27.62,70.82 13.65,79.46 22.8,50.25 21.02,25.61 12.38,90.12 13.4,62.18 25.34,119.33 25.34,112.98 24.32,107.9 25.59,83.01 37.53,32.21 3.49,99.27 37.02,4.53 39.31,97.74 9.34,98.25 30.93,103.33 58.36,111.46 17.97,102.57
  pour Top: -22.67,154.13 79.95,154.13 79.95,-7.92 -22.67,-7.92
  pour Bottom: -12,154.13 86.04,154.13 86.04,-6.9 -12,-6.9
INT_01  (via drill 0.35)
  Top 0.2: JP4_RX7.3 39.31,102.32 39.31,102.41 39.31,103.71 39.61,104.01 39.61,104.81 38.31,106.11 38.31,107.21 39.91,108.81 39.91,109.41 38.18,111.14 36.24,111.14 34.69,112.68 34.13,112.68 34.06,112.62 33.36,112.62 32.1,113.87 32.1,113.91 | 32.1,113.91 30.31,115.71 22.31,115.71 v22.01,115.41 | 32.1,113.91 32.11,113.91 | v18.41,119.01 v20.41,117.01 | I2C.5 4.01,117.71 4.61,117.71 I2C.5 | I2C.5 5.15,117.68 6.33,118.87 6.33,120.19 7.81,121.66 8.09,121.66 8.11,121.68 11.31,121.68 11.81,121.18 16.68,121.18 v17.01,121.51
  Bottom 0.2: v20.41,117.01 v22.01,115.41 | v18.41,119.01 18.01,119.01 17.01,120.01 v17.01,121.51 v17.01,123.21
INT_02  (via drill 0.35)
  Top 0.2: JP3_TX7.3 35.5,102.32 35.51,102.41 35.51,109.91 30.21,115.21 26.21,115.21 v26.01,115.01 | v13.41,118.01 15.11,119.71 18.71,119.71 19.48,118.93 20.09,118.93 20.24,119.08 23.47,119.08 24.63,117.92 24.63,117.52 25.03,117.13 25.42,117.13 25.61,116.94 v25.61,116.81 25.35,117.06 | v12.41,117.01 10.81,117.01 10.21,117.61 I2C.6
  Bottom 0.2: v26.01,115.01 26.01,116.41 v25.61,116.81 | v12.41,117.01 v13.41,118.01
MA1_01
  Bottom 0.406: MOTOR_01.A1 63.67,24.87 CM_01.1
MA1_02
  Bottom 0.406: MOTOR_02.A1 16.55,24.95 CM_02.1
MA1_03
  Bottom 0.406: MOTOR_03.A1 39.9,10.15 CM_03.1
MA1_04
  Bottom 0.406: MOTOR_04.A1 40.03,46.26 CM_04.1
MA1_05
  Bottom 0.406: MOTOR_05.A1 56.07,121.72 CM_05.1
MA1_06
  Bottom 0.406: 8.32,121.52 MOTOR_06.A1 8.21,127.61 CM_06.1
MA1_07
  Bottom 0.406: MOTOR_07.A1 32.18,142.34 CM_07.1
MA1_08
  Bottom 0.406: CM_08.1 32.66,94.7 MOTOR_08.A1
MA2_01
  Bottom 0.406: MOTOR_01.A2 61.13,24.87 CM_01.2
MA2_02
  Bottom 0.406: 14.01,24.95 CM_02.2 14.01,24.95 | MOTOR_02.A2 14.01,24.95
MA2_03
  Bottom 0.406: CM_03.2 37.66,13.8 37.89,14.03 37.93,14.07 37.97,14.1 39.05,15.19 39.05,17.23 37.28,19 37.28,25.35 37.36,25.44 MOTOR_03.A2
MA2_04
  Bottom 0.406: MOTOR_04.A2 37.49,46.26 CM_04.2
MA2_05
  Bottom 0.406: 58.61,121.72 MOTOR_05.A2 58.56,126.9 CM_05.2
MA2_06
  Bottom 0.406: 10.86,121.52 MOTOR_06.A2 10.86,121.52 | CM_06.2 10.86,121.52
MA2_07
  Bottom 0.406: MOTOR_07.A2 34.64,130.6 34.64,132.89 33.28,134.26 33.28,137.43 34.64,138.8 CM_07.2
MA2_08
  Bottom 0.406: CM_08.2 32.66,97.24 MOTOR_08.A2
MB1_01
  Bottom 0.406: CM_01.4 56.07,30.56 MOTOR_01.B1
MB1_02
  Bottom 0.406: CM_02.4 8.83,30.48 MOTOR_02.B1
MB1_03
  Bottom 0.406: MOTOR_03.B1 32.28,21.29 31.97,20.98 31.97,10.47 CM_03.4
MB1_04
  Bottom 0.406: CM_04.4 32.32,51.82 MOTOR_04.B1
MB1_05
  Bottom 0.406: 63.69,121.72 MOTOR_05.B1 63.69,121.72 | CM_05.4 63.69,121.72
MB1_06
  Bottom 0.406: MOTOR_06.B1 15.94,121.52 CM_06.4
MB1_07
  Bottom 0.406: MOTOR_07.B1 39.72,130.6 CM_07.4
MB1_08
  Bottom 0.406: CM_08.4 32.66,102.32 MOTOR_08.B1
MB2_01
  Bottom 0.406: MOTOR_01.B2 58.59,24.87 CM_01.3
MB2_02
  Bottom 0.406: CM_02.3 11.37,30.48 MOTOR_02.B2
MB2_03
  Bottom 0.406: CM_03.3 35.12,13.01 32.96,15.17 32.96,16.97 34.82,18.84 MOTOR_03.B2
MB2_04
  Bottom 0.406: MOTOR_04.B2 34.95,46.26 CM_04.3
MB2_05
  Bottom 0.406: 61.15,121.72 MOTOR_05.B2 61.15,121.72 | CM_05.3 61.15,121.72
MB2_06
  Bottom 0.406: MOTOR_06.B2 13.4,121.52 CM_06.3
MB2_07
  Bottom 0.406: 37.18,130.6 MOTOR_07.B2 37.53,130.79 37.53,133.66 38.72,134.86 38.72,137.14 37.53,138.34 37.53,142.07 CM_07.3
MB2_08
  Bottom 0.406: CM_08.3 32.66,99.78 MOTOR_08.B2
MDIR_01  (via drill 0.35)
  Top 0.2: v27.21,87.71 27.21,93.51 28.51,94.81 28.51,95.81 U$3.6 | 56.81,7.21 56.58,7.21 | v68.41,42.11 67.78,41.48 67.78,32.09 67.98,31.89 67.98,31.32 67.78,31.12 67.78,18.21 56.8,7.23 56.61,7.23 56.58,7.21 | 15.26,27.05 15.26,26.37 | 15.26,26.37 15.26,24.35 15.96,23.66 18.65,23.66 22.61,19.7 22.61,7.57 22.12,7.09 20.52,7.09 20.34,6.91 20.34,3.66 21,3 32.22,3 33.97,1.25 35,1.25 35.65,1.91 49.15,1.91 51.16,3.92 51.16,5.2 53.16,7.21 56.58,7.21 | 15.26,26.37 15.26,27.32 2.67,39.91 2.54,39.91 2.31,40.14 2.31,42.05 2.03,42.32 2.03,42.89 2.31,43.16 2.31,44.32 2.13,44.15 v2.03,44.15 | v9.61,48.01 9.28,47.68 7.91,47.68 7.45,47.22 4.88,47.22 4.49,47.61 v3.92,47.61
  Bottom 0.2: v68.41,42.11 68.71,42.41 68.71,44.51 MOTOR_01.DIR | v27.21,87.71 26.77,87.71 25.59,86.53 25.59,85.81 20.51,80.73 20.51,79.81 20.51,71.21 9.51,60.21 9.51,52.31 10.31,51.51 10.31,50.71 9.61,50.01 v9.61,48.01 | v2.03,44.15 2.22,44.35 2.22,46.94 2.23,46.94 2.29,46.94 2.96,47.61 v3.92,47.61
MDIR_02  (via drill 0.35)
  Top 0.2: v9.81,61.51 9.81,53.41 14.51,48.71 v15.81,48.71 | v16.91,47.61 16.19,46.89 16.19,46.78 18.07,44.91 19.51,44.91 v20.41,45.81
  Bottom 0.2: 20.11,80.01 20.11,79.96 | 20.11,79.96 20.11,71.51 10.11,61.51 v9.81,61.51 | v16.91,47.61 v15.81,48.71 | v20.41,45.81 21.61,44.61 MOTOR_02.DIR | U$3.8 28.51,90.81 28.51,90.01 25.11,86.61 25.11,86.04 20.11,81.04 20.11,79.96
MDIR_03  (via drill 0.35)
  Top 0.2: v27.41,81.41 27.41,80.31 31.51,76.21 31.61,76.21 32.11,75.71 32.11,73.35 | v40.71,68.51 39.81,69.41 39.01,69.41 38.71,69.11 38.34,69.11 38.32,69.09 38.08,69.09 37.79,69.38 36.89,69.38 36.33,69.95 35.33,69.95 32.78,72.49 32.78,72.89 32.39,73.28 32.17,73.28 32.11,73.35 | v44.11,58.61 44.21,58.71 44.21,61.07 41.47,63.81 v41.31,63.81 | v40.51,54.81 40.51,52.81 44.01,49.31 44.01,38.81 44.91,37.91 v44.91,37.51 | 32.11,73.35
  Bottom 0.2: v27.41,81.41 27.41,83.61 28.51,84.71 28.51,85.71 U$3.10 | v40.71,68.51 41.31,67.91 v41.31,63.81 | v44.11,58.61 40.51,55.01 v40.51,54.81 | v44.91,37.51 44.91,39.91 MOTOR_03.DIR
MDIR_04  (via drill 0.35)
  Top 0.2: v41.51,69.21 40.61,69.21 40.01,69.81 39.05,69.81 36.26,72.6 36.26,78.49 35.13,79.62 30.64,79.62 29.6,80.66 U$3.12 28.61,80.61
  Bottom 0.2: v41.51,69.21 42.31,68.41 42.81,68.41 44.21,67.01 44.61,67.01 45.01,66.61 45.01,65.91 MOTOR_04.DIR
MDIR_05  (via drill 0.35)
  Top 0.2: v50.91,104.71 49.01,102.81 49.01,90.37 47.6,88.96 45.91,88.96 44.8,87.85 | U$3.15/A1 43.81,85.81 43.81,86.85 44.8,87.85 | 44.8,87.85 | 44.8,87.85
  Bottom 0.2: v50.91,104.71 50.91,107.61 MOTOR_05.DIR
MDIR_06
  Bottom 0.2: 17.26,104.55 16.02,103.31 6.41,103.31 3.21,106.51 3.21,107.41 MOTOR_06.DIR | 17.26,104.55 17.52,104.81 | U$3.21/A7 43.71,101.01 41.11,103.61 38.61,103.61 37.41,104.81 37.38,104.78 28.33,104.78 27.13,103.59 18.99,103.59 18.48,104.09 18.48,104.39 18.09,104.78 17.53,104.78 17.29,104.55 17.26,104.55
MDIR_07  (via drill 0.35)
  Top 0.2: v47.91,111.31 47.91,109.41 47.51,109.01 47.31,109.01 44.41,106.11 43.81,106.11 U$3.23/A9 | v33.61,117.81 33.61,117.46 34.28,116.79 34.28,116.14 36.53,113.9 41.34,113.9 42.16,114.71 44.2,114.71 45.5,113.41 v47.91,113.41
  Bottom 0.2: v47.91,113.41 v47.91,111.31 | v33.61,117.81 33.01,118.41 33.01,118.51 32.41,119.11 28.81,119.11 27.11,117.41 27.11,116.61 MOTOR_07.DIR
MDIR_08  (via drill 0.35)
  Top 0.2: 38.71,88.31 U$3.27 38.75,88.35 39.68,88.35 39.71,88.37 39.71,88.87 42.51,91.67 v42.51,92.11
  Bottom 0.2: v42.51,92.11 44.51,92.11 46.01,90.61 MOTOR_08.DIR
MMS1  (via drill 0.35)
  Top 0.2: v67.91,95.81 v67.91,76.11 | JP4_RX7.1 37.21,101.31 37.21,102.81 36.21,103.81 v36.21,108.81 36.21,109.81 34.41,111.61 v34.41,112.01 | v30.91,109.71 v27.71,109.71 | v30.31,37.51 30.31,35.41 30.01,35.11 30.01,33.01 27.31,30.31 18.31,30.31 13.71,34.91 v13.71,35.21 | v11.71,35.21 11.71,35.61 6.71,40.61 v6.31,40.61 | v64.41,115.81 63.41,116.81 60.11,116.81 v59.11,117.81 | v57.21,122.31 41.81,122.31 39.91,120.41 39.91,119.81 42.01,117.71 v43.51,117.71 | v3.88,94 3.88,94.62 8.97,99.71 10.53,99.71 11.1,100.28 11.11,100.28 12.64,101.81 12.64,103.59 13.46,104.41 v15.31,104.41 | 16.46,70.06 v16.21,69.81 16.54,69.81 16.79,70.06 20.01,70.06 20.68,69.39 20.68,69.2 21.02,68.87 24.24,68.87 25.08,68.03 25.65,68.03 26.87,66.81 28.31,66.81 v28.61,67.11
  Bottom 0.2: v67.91,95.81 67.01,96.71 67.01,105.51 66.21,106.31 66.21,107.61 MOTOR_05.MS1 66.21,107.71 67.83,109.34 67.83,114.41 66.44,115.81 v64.41,115.81 | MOTOR_01.MS1 53.61,44.61 53.61,45.71 58.11,50.21 59.01,50.21 62.31,53.51 62.31,56.66 62.73,57.08 63.12,57.08 65.32,59.29 65.32,60.93 64.11,62.14 64.11,69.27 67.23,72.39 67.23,72.79 67.91,73.46 v67.91,76.11 | 18.41,107.71 18.41,107.51 | v30.91,109.71 33.21,112.01 v34.41,112.01 | 18.41,107.51 MOTOR_06.MS1 18.31,107.41 18.31,107.21 15.51,104.41 v15.31,104.41 | 7.21,55.51 7.21,58.71 8.31,59.81 8.31,65.71 12.41,69.81 v16.21,69.81 | 7.21,55.51 7.21,48.61 6.41,47.81 6.41,44.61 MOTOR_02.MS1 6.31,44.51 5.81,44.01 5.81,41.81 6.31,41.31 v6.31,40.61 | v28.61,67.11 29.81,65.91 MOTOR_04.MS1 | v30.31,37.51 29.81,38.01 29.81,39.91 MOTOR_03.MS1 | v11.71,35.21 v13.71,35.21 | 7.21,55.51 5.81,55.51 5.41,55.91 5.41,57.48 3.48,59.4 3.48,61.19 2.51,62.16 2.51,84.03 | v59.11,117.81 59.11,118.41 57.21,120.31 v57.21,122.31 | v43.51,117.71 42.41,116.61 MOTOR_07.MS1 | v3.88,94 2.51,92.62 2.51,84.03 | 2.51,84.03 2.51,83.86 | 42.34,114.95 42.13,114.74 | 42.13,114.74 40.85,113.46 39.72,113.46 36.21,109.94 v36.21,108.81 | v27.71,109.71 26.58,109.71 26.03,110.26 20.33,110.26 18.23,108.16 18.41,107.98 18.41,107.51 | MOTOR_07.MS1 | MOTOR_07.MS1 42.31,116.51 MOTOR_07.MS1 | MOTOR_07.MS1 | MOTOR_07.MS1 42.13,116.34 42.13,114.74
MMS2  (via drill 0.35)
  Top 0.2: v27.01,110.41 27.01,113.71 28.11,114.81 29.61,114.81 v33.31,111.11 34.01,110.41 34.01,109.81 33.51,109.31 33.51,102.11 33.51,101.31 JP3_TX7.1 30.48,101.3 29.76,102.01 28.1,102.01 27.38,101.3 27.31,101.3 | v47.91,114.41 47.91,115.21 47.61,115.51 47.61,119.31 46.91,120.01 v41.61,120.01 | v6.8,39.26 6.8,38.11 v9.51,35.41 | v23.81,37.71 26.01,37.71 v28.31,40.01 | v55.31,33.41 55.31,31.91 53.61,30.21 49.6,30.21 v49,29.61 | v28.91,69.31 v31.01,67.21 | 27.31,101.31 27.31,101.3 | 27.31,101.3 27.31,99.41 v26.81,98.91 | v16.51,80.81 17.51,79.81 17.51,79.71 18.01,79.21 20.21,79.21 20.61,79.61 v21.31,79.61 | v40.71,12.91 40.71,22.21 v38.81,24.11 | v14.71,69.11 16.47,69.11 16.88,69.52 16.88,69.59 16.96,69.66 19.45,69.66 v20.01,69.11
  Bottom 0.2: v33.31,111.11 32.61,110.41 32.61,109.81 33.01,109.41 33.61,109.41 39.71,115.51 39.71,116.51 MOTOR_07.MS2 39.81,116.61 39.81,118.21 v41.61,120.01 | MOTOR_06.MS2 15.91,107.51 15.91,109.48 17.08,110.66 26.75,110.66 v27.01,110.41 | v47.91,114.41 50.21,112.11 50.81,112.11 51.11,112.41 59.11,112.41 63.61,107.91 63.61,107.71 MOTOR_05.MS2 | v6.8,39.26 8.91,41.37 8.91,44.51 MOTOR_02.MS2 8.91,44.61 8.91,49.51 8.71,49.71 8.71,65.51 12.31,69.11 v14.71,69.11 | v9.51,35.41 9.64,35.41 10.64,36.41 22.7,36.41 23.51,35.61 24.11,35.61 24.51,36.01 24.51,37.01 v23.81,37.71 | v28.31,40.01 28.31,41.21 29.11,42.01 30.41,42.01 32.21,40.21 32.21,40.01 MOTOR_03.MS2 32.31,39.91 32.31,39.71 34.21,37.81 34.31,37.81 38.08,34.03 38.51,33.61 38.81,33.31 v38.81,24.11 | v55.31,33.41 55.31,34.21 54.31,35.21 54.31,38.51 56.61,40.81 56.61,41.71 56.11,42.21 56.11,44.51 MOTOR_01.MS2 | v49,29.61 49,29.5 47.61,28.11 44.41,28.11 43.31,27.01 43.31,24.11 40.71,21.51 v40.71,12.91 | v31.01,67.21 32.31,65.91 MOTOR_04.MS2 | 25.31,69.31 20.21,69.31 v20.01,69.11 | 25.31,69.31 v28.91,69.31 | v26.81,98.91 25.11,98.91 24.71,98.51 23.81,98.51 22.21,96.91 22.21,92.31 15.51,85.61 15.52,85.6 15.52,85.02 15.91,84.62 16.23,84.62 17.77,83.08 17.77,80.78 17.46,80.47 16.84,80.47 v16.51,80.81 | v21.31,79.61 21.31,79.01 25.31,75.01 25.31,69.31
MSTEP_01  (via drill 0.35)
  Top 0.2: v51.41,71.01 42.71,79.71 42.71,81.14 42.14,81.71 37.04,81.71 34.05,84.7 33.11,84.7 32.51,85.31 32.51,94.01 28.61,97.91 28.61,98.41 U$3.5 | v56.91,65.11 59.71,65.11 66.31,58.51 69.31,58.51 69.61,58.21 69.61,48.41 v67.31,46.11
  Bottom 0.2: v51.41,71.01 51.41,70.41 56.71,65.11 v56.91,65.11 | v67.31,46.11 67.11,45.91 66.71,45.91 66.31,45.51 66.31,44.61 MOTOR_01.STEP
MSTEP_02  (via drill 0.35)
  Top 0.2: v20.21,85.81 20.41,85.81 21.81,84.41 24.01,84.41 24.61,83.81 v24.61,74.71 | v17.71,63.21 20.11,63.21 23.01,60.31 v23.41,60.31 | v26.61,55.81 26.38,55.58 25.95,55.58 19.11,48.73 v19.11,48.31
  Bottom 0.2: 24.7,93.3 20.21,88.81 v20.21,85.81 | 24.7,93.3 24.71,93.31 | v24.61,74.71 16.81,66.91 16.81,64.11 v17.71,63.21 | v23.41,60.31 23.41,59.41 26.61,56.21 v26.61,55.81 | v19.11,48.31 19.11,44.61 MOTOR_02.STEP | 24.7,93.3 25.59,94.19 28.39,94.19 28.53,94.05 U$3.7
MSTEP_03  (via drill 0.35)
  Top 0.2: v35.81,68.31 35.51,68.01 30.96,68.01 30.42,68.54 30.42,68.72 v31.01,69.31 | v36.21,64.41 37.61,64.41 38.21,63.81 38.21,62.11 37.01,60.91 37.01,57.91 37.31,57.61 38.91,57.61 39.81,56.71 39.81,52.8 42.13,50.47 42.13,49.22 43.01,48.35 43.01,44.61 v42.71,44.31
  Bottom 0.2: v35.81,68.31 36.21,67.91 v36.21,64.41 | v42.71,44.31 42.71,42.21 42.51,42.01 42.51,40.01 MOTOR_03.STEP | 28.51,88.21 U$3.9 28.53,86.96 28.34,86.77 28.1,86.77 27.49,86.17 27.49,85.31 27.82,84.97 27.82,84.59 27.01,83.77 27.01,81.96 26.73,81.69 26.73,80.99 27.62,80.09 27.62,72.69 v31.01,69.31
MSTEP_04  (via drill 0.35)
  Top 0.2: 35.11,80.47 35.11,80.21 35.91,79.41 42.31,79.41 49.71,72.01 v49.71,70.31 | 35.11,80.71 35.11,80.47 | v52.51,64.91 51.57,64.91 51.27,64.61 47.05,64.61 45.51,63.06 v45.51,62.81 | U$3.11 28.96,83.2 29.65,82.51 31.27,82.51 32.29,81.49 32.97,81.49 33.18,81.69 34.04,81.69 34.64,81.09 34.64,80.93 35.11,80.47
  Bottom 0.2: v49.71,70.31 49.71,69.91 52.51,67.11 v52.51,64.91 | 43.01,64.61 42.61,65.01 42.61,65.49 | 42.61,65.49 42.61,65.81 MOTOR_04.STEP | v45.51,62.81 45.04,62.81 44.68,63.16 44.68,63.19 44.29,63.58 44.26,63.58 42.61,65.24 42.61,65.49
MSTEP_05  (via drill 0.35)
  Top 0.2: v49.41,87.91 49.41,102.21 v52.61,105.41
  Bottom 0.2: v49.41,87.91 44.71,83.21 43.81,83.21 U$3.14/A0 | v52.61,105.41 52.61,106.81 53.41,107.61 MOTOR_05.STEP
MSTEP_06  (via drill 0.35)
  Top 0.2: v52.11,109.11 47.41,104.41 47.41,100.73 45.12,98.44 U$3.20/A6 | v53.51,110.11 53.51,117.51 v53.21,117.81 | v3.61,124.61 4.05,124.16 5.89,124.16 6.04,124.31 8.23,124.31 8.49,124.05 16.33,124.05 16.56,124.28 17.59,124.28 18.57,123.31 28.22,123.31 30.85,120.68 35.67,120.68 35.86,120.5 38.3,120.5 41.31,123.51 44.81,123.51 v45.91,124.61
  Bottom 0.2: v52.11,109.11 53.11,110.11 v53.51,110.11 | v3.61,124.61 2.31,123.31 2.31,112.01 5.61,108.71 5.61,107.51 MOTOR_06.STEP | 53.21,118.06 v53.21,117.81 52.53,118.48 51.93,118.48 51.76,118.32 50.23,118.32 48.98,119.56 48.98,120.29 48.59,120.68 48.19,120.68 48.08,120.79 48.08,121.69 47.64,122.13 46.67,122.13 45.91,122.9 v45.91,124.61
MSTEP_07
  Bottom 0.2: U$3.22/A8 43.71,103.61 40.21,107.11 30.91,107.11 29.71,108.31 29.71,116.51 MOTOR_07.STEP
MSTEP_08  (via drill 0.35)
  Top 0.2: v46.51,94.31 44.51,92.31 43.71,92.31 40.11,88.71 40.11,88.21 38.71,86.81 38.71,85.81 U$3.26
  Bottom 0.2: v46.51,94.31 47.61,93.21 MOTOR_08.STEP
N$1
  Top 0.2: R8.2 65.71,81.91 65.71,77.71 65.01,77.01 J1.1
N$2
  Top 0.2: D1.4 4.41,87.91 5.81,86.51 9.31,86.51 13.61,82.21 14.11,82.21 Z3120V.C 14.21,82.11 19.01,77.31 19.01,73.11 U1.1
N$3  (via drill 0.35)
  Top 0.2: v43.61,56.51 41.41,56.51 R4.2 | v45.41,54.71 47.33,54.71 50.66,51.38 50.66,47.26 v50.41,47.01 | v57.71,42.31 58.68,42.31 59.37,41.61 59.37,41.11 58.79,40.53 58.59,40.53 57.89,39.83 57.89,29.91 47.31,19.33 47.31,9.98 v45.4,8.08 | 34.89,2.24 34.74,2.24 34.71,2.31 34.51,2.51 J2.1 34.91,2.31 42.81,2.31 | 42.81,2.31 | 42.81,2.31 44.9,4.4 v44.9,5.8
  Bottom 0.2: v45.41,54.71 v43.61,56.51 | v50.41,47.01 51.31,47.01 52.61,45.71 52.61,42.71 52.91,42.41 54.11,42.41 55.21,43.51 55.21,46.51 55.41,46.71 56.71,46.71 57.71,45.71 v57.71,42.31 | v44.9,5.8 44.9,7.57 v45.4,8.08
N$4
  Top 0.2: SMAJ24A.C 22.61,82.21 22.61,78.51 R1.1 22.61,78.41 22.61,77.51 21.01,75.91 21.01,75.71 C1.2 21.01,75.61 21.01,73.51 22.71,71.81 23.41,71.81 U1.6
N$9
  Top 0.2: C8.1 13.41,71.01 16.11,71.01 C7.2
N$12
  Top 0.2: SMAT70A.A 18.41,86.51 22.51,86.51 SMAJ24A.A
N$193
  Top 0.2: R10.1 67.91,52.31 67.91,56.41 68.61,57.11 STATUS_LED.1
NEOPIXEL_01  (via drill 0.35)
  Top 0.2: v41.41,100.91 41.41,103.91 41.31,104.01 41.31,105.11 43.71,107.51 45.01,107.51 v47.21,109.71 | v48.31,115.81 48.61,115.81 54.15,121.35 57.25,121.35 58.61,122.71 62.11,122.71 NOE_PIXELS.1
  Bottom 0.2: v41.41,100.91 41.41,91.11 43.71,88.81 43.71,88.31 U$3.16/A2 | v47.21,109.71 47.21,114.71 v48.31,115.81
NEOPIXEL_02
  Top 0.2: U$3.17/A3 43.81,90.91 47.46,90.91 48.21,91.66 48.21,103.61 54.34,109.74 54.18,109.89 54.18,110.39 53.91,110.66 53.91,117.85 55.08,119.02 55.08,119.36 55.53,119.81 60.65,119.81 61.04,119.41 63.47,119.41 66.76,122.71 67.81,122.71 NOE_PIXELS.2
NEOPIXEL_03  (via drill 0.35)
  Top 0.2: v33.31,110.11 33.11,109.91 33.11,108.11 31.11,106.11 28.61,106.11 U$3.2 | v40.61,120.11 41.21,120.71 51.71,120.71 v52.11,120.31 | v54.41,119.31 55.31,120.21 62.11,120.21 NOE_PIXELS.3
  Bottom 0.2: v33.31,110.11 33.61,110.11 38.91,115.41 38.91,118.41 v40.61,120.11 | v52.11,120.31 53.11,119.31 v54.41,119.31
NEOPIXEL_04  (via drill 0.35)
  Top 0.2: v23.11,112.31 26.04,109.37 26.04,107.07 28.51,104.61 28.51,103.61 U$3.3 | v67.61,121.61 67.81,121.41 67.81,120.31 NOE_PIXELS.4 | 45.41,125.71 45.27,125.57 | 45.27,125.57 44.71,125.01 43.55,125.01 43.13,124.59 43.13,124.17 42.86,123.91 41.14,123.91 38.13,120.9 36.03,120.9 35.84,121.08 31.01,121.08 28.39,123.71 18.74,123.71 17.76,124.68 15.23,124.68 v15.11,124.81 15.31,125.01 | v19.81,119.61 23.51,119.61 v25.31,117.81 | 45.27,125.57 45.3,125.57 45.44,125.71 46.33,125.71 46.98,125.05 46.98,125.03 48.03,123.99 56.23,123.99 56.43,124.18 58.08,124.18 58.36,123.91 60.18,123.91 60.95,124.68 64.3,124.68 64.39,124.74 64.62,124.68 65.48,124.68 v66.81,126.01
  Bottom 0.2: v23.11,112.31 23.11,115.31 25.46,117.66 25.41,117.71 v25.31,117.81 | v67.61,121.61 67.61,125.21 v66.81,126.01 | v15.11,124.81 15.11,123.41 15.01,123.31 15.01,119.51 16.21,118.31 18.71,118.31 19.81,119.41 v19.81,119.61
NEOPIXEL_05
  Top 0.2: 48.61,94.19 48.61,103.41 54.74,109.54 54.74,115.94 57.31,118.51 59.81,118.51 60.61,117.71 61.81,117.71 NOE_PIXELS.5 | 48.61,94.19 48.61,94.11 | 48.61,94.19 48.61,90.53 47.44,89.36 43.36,89.36 42.71,88.71 42.71,85.71 41.21,84.21 38.11,84.21 37.21,85.11 37.21,88.71 35.61,90.31 35.61,92.91 31.8,96.72 31.8,99.41 30.23,100.98 U$3.4
NEOPIXEL_06  (via drill 0.35)
  Top 0.2: v36.11,96.01 36.11,94.61 v37.51,93.21 | 51.61,118.21 54.21,120.81 54.31,120.91 v59.71,120.91 | 51.61,118.21 51.51,118.11 | 69.91,122.51 70.01,122.41 70.01,119.01 68.71,117.71 68.11,117.71 NOE_PIXELS.6 67.81,117.71 67.11,117.71 v65.51,119.31 | v40.31,96.01 40.31,105.67 42.73,108.09 42.73,109.03 43.34,109.63 44.24,109.63 47.31,112.71 48.21,112.71 48.58,113.08 48.58,115.12 48.98,115.52 48.98,115.58 51.61,118.21 | 31.46,96.31 v31.21,96.31 31.64,96.31 35.21,92.74 35.21,89.21 v35.01,89.01
  Bottom 0.2: v35.01,89.01 35.01,85.41 35.81,84.61 36.51,84.61 37.21,85.31 37.21,85.81 38.21,86.81 39.11,86.81 40.11,85.81 41.21,85.81 U$3.24 | v31.21,96.31 31.51,96.31 31.71,96.51 35.61,96.51 v36.11,96.01 | v40.31,96.01 v37.51,93.21 | v65.51,119.31 60.71,119.31 59.71,120.31 v59.71,120.91
NEOPIXEL_07  (via drill 0.35)
  Top 0.2: v42.41,95.51 37.61,90.71 37.61,85.31 38.31,84.61 39.11,84.61 39.81,85.31 39.81,85.81 41.21,87.21 41.21,88.21 U$3.25 | v43.11,99.71 45.53,99.71 47.01,101.18 47.01,104.57 51.41,108.97 51.41,109.41 v52.11,110.11 | v56.71,111.71 60.61,115.61 61.81,115.61 NOE_PIXELS.7
  Bottom 0.2: v42.41,95.51 42.41,99.01 v43.11,99.71 | v52.11,110.11 52.51,110.11 54.11,111.71 v56.71,111.71